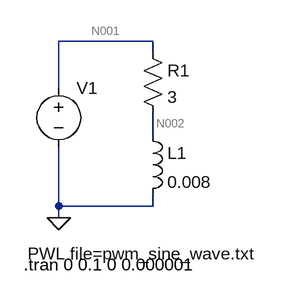
[diagram p0: schematic motor-phase.asc]
motor-phase.asc, the LTspice schematic file:
Version 4
SHEET 1 880 680
WIRE 256 -48 128 -48
WIRE 256 -32 256 -48
WIRE 128 16 128 -48
WIRE 256 80 256 48
WIRE 128 176 128 96
WIRE 256 176 256 160
WIRE 256 176 128 176
WIRE 128 192 128 176
FLAG 128 192 0
SYMBOL ind 240 64 R0
SYMATTR InstName L1
SYMATTR Value 0.008
SYMBOL res 240 -48 R0
SYMATTR InstName R1
SYMATTR Value 3
SYMBOL voltage 128 0 R0
WINDOW 3 -42 241 Left 2
WINDOW 123 0 0 Left 0
WINDOW 39 0 0 Left 0
SYMATTR Value PWL file=pwm_sine_wave.txt
SYMATTR InstName V1
TEXT 80 256 Left 2 !.tran 0 0.1 0 0.000001

The netlist it stands for:
* motor-phase.asc
L1 N002 0 0.008
R1 N001 N002 3
V1 N001 0 PWL file=pwm_sine_wave.txt
.tran 0 0.1 0 0.000001
.backanno
.end

* Results of the author's LTspice run, read from the files saved beside the schematic
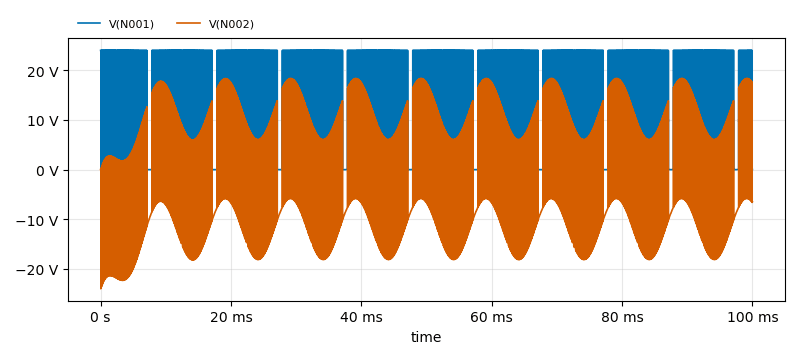
[diagram p1: Transient Analysis of motor-phase.asc, plotted from the saved traces]
* Transient Analysis, 1 run:
*   V(N001): min 0 V, max 24 V, average 11.89 V, rms 16.89 V, last 0 V
*   V(N002): min -23.99 V, max 18.35 V, average -463.5 mV, rms 11.14 V, last -6.479 V